# Altium project TK525_Kraftforsyning.PrjPcb
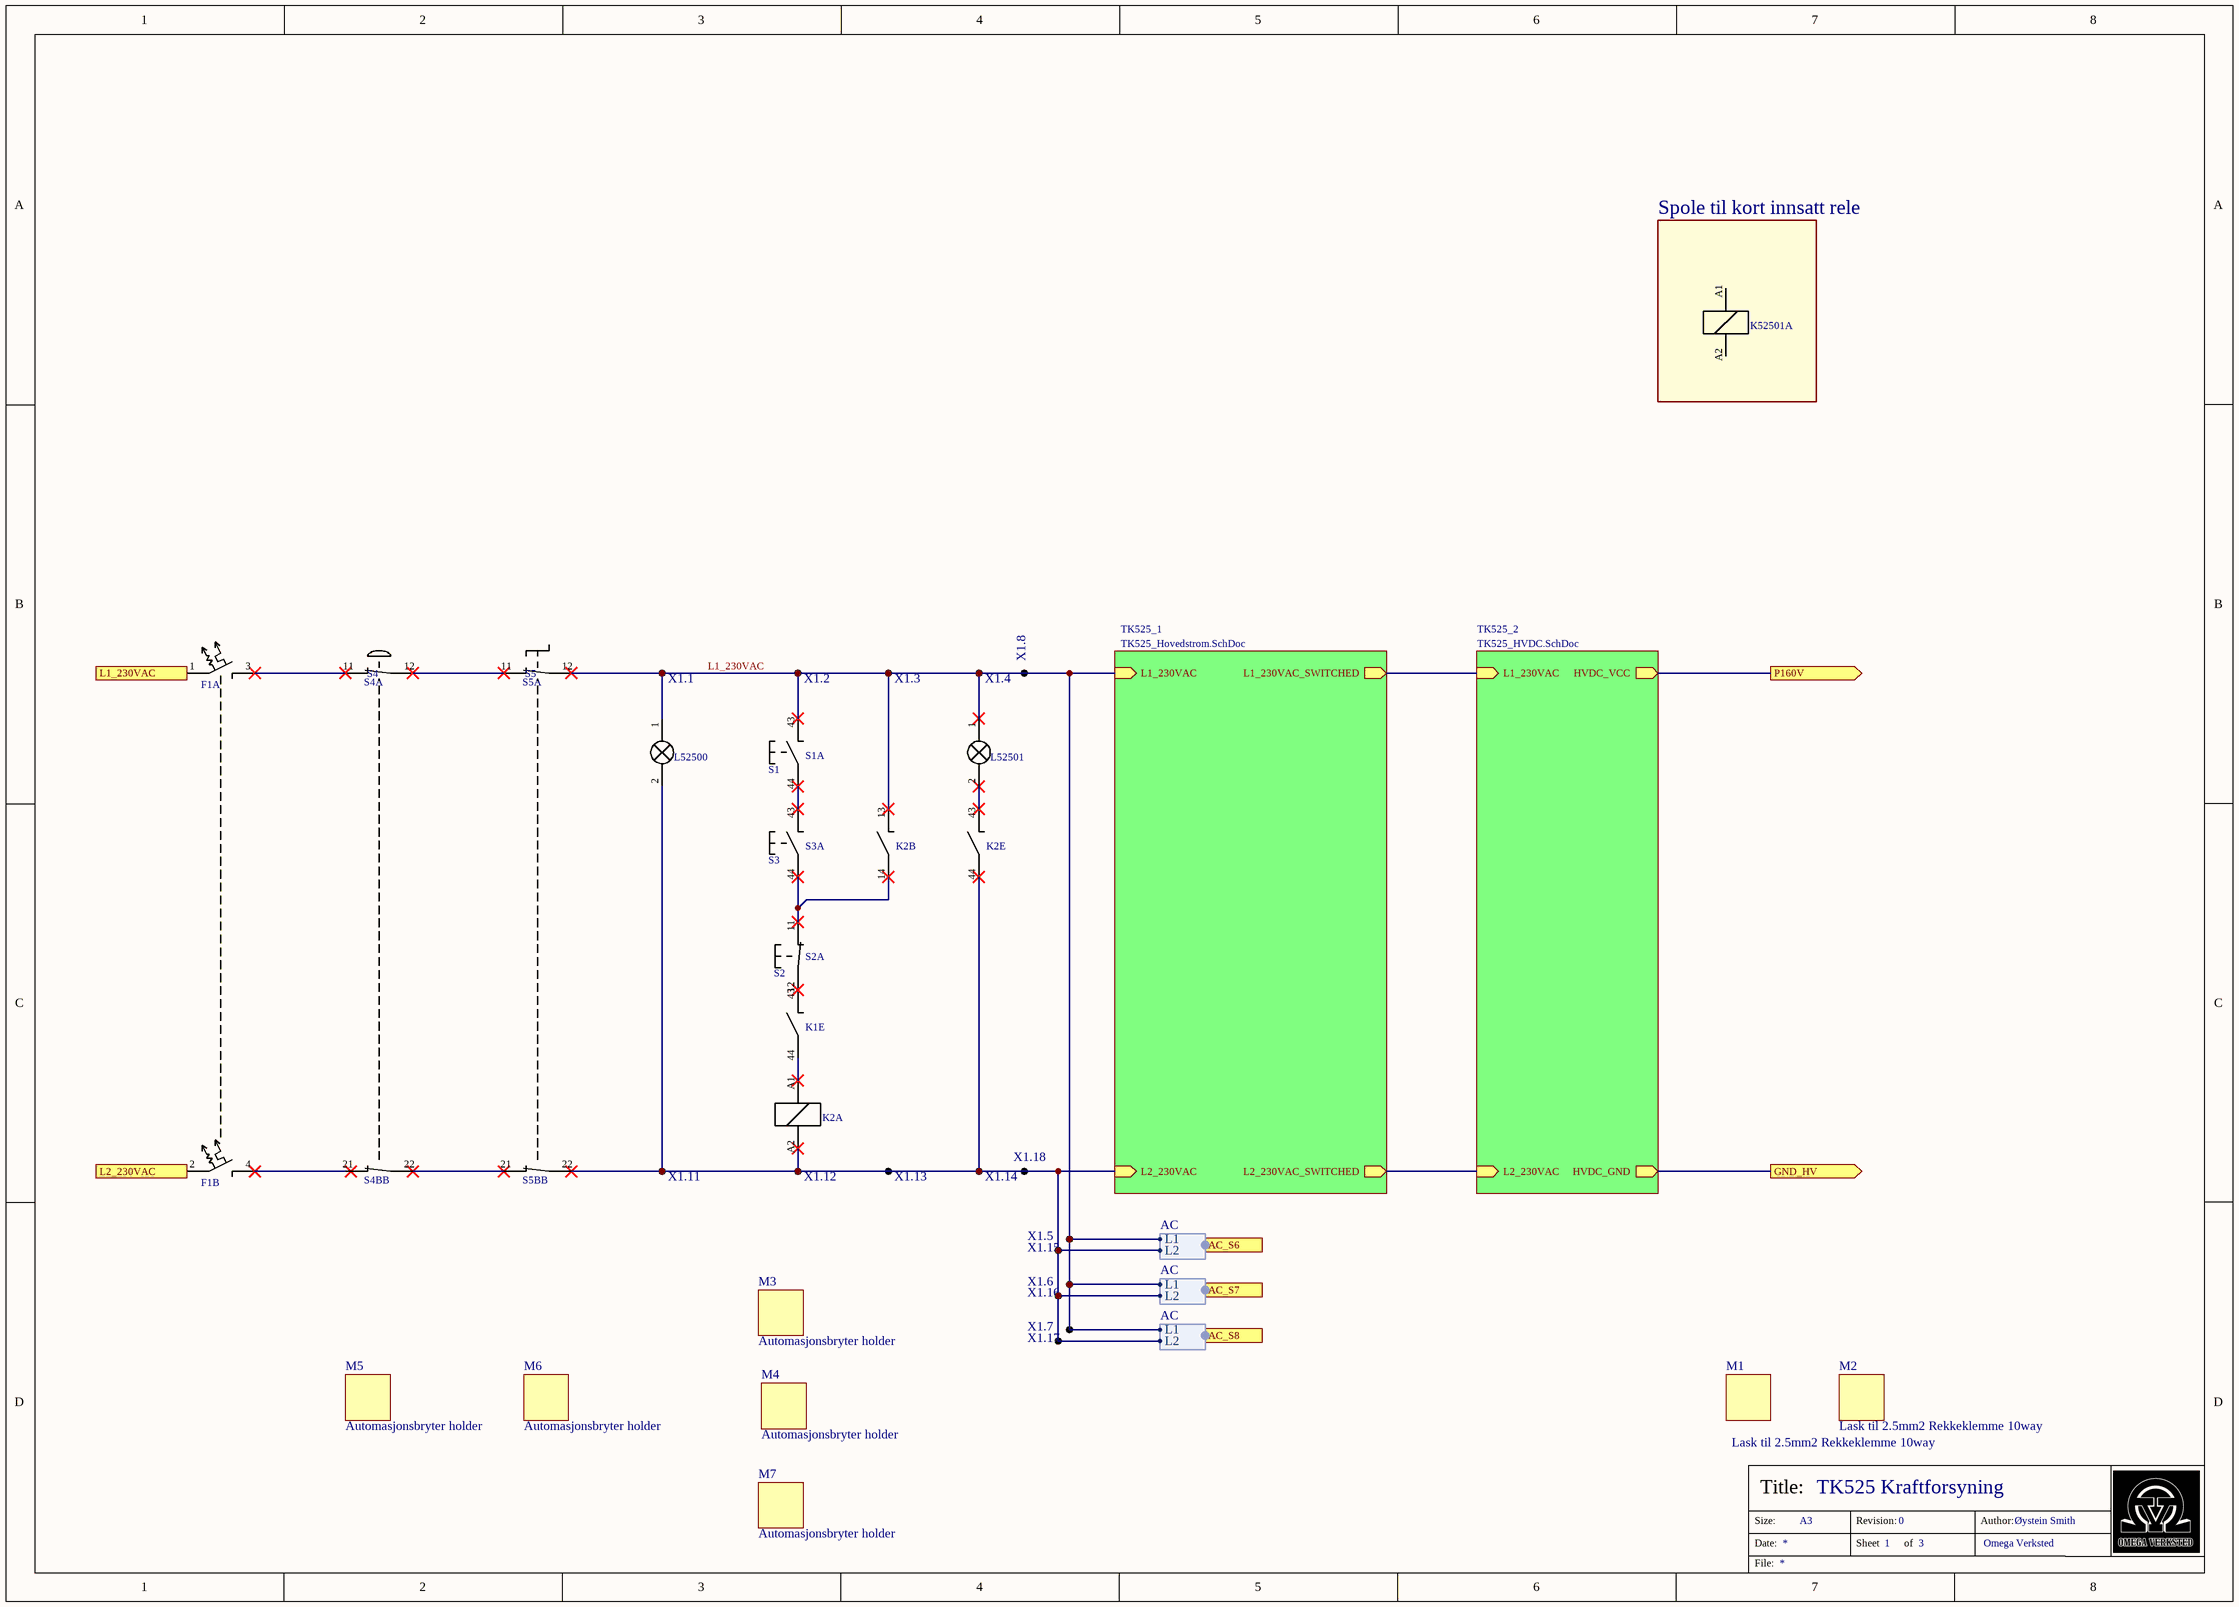
[diagram p0: TK525_Kraftforsyning.SchDoc]
3 sheets, 60 parts. Net scope: hierarchical (ports join the sheet entries above them; power ports are global).
Board file: dummy.PcbDoc
Sheets:
  TK525_Kraftforsyning.SchDoc
    TK525_1 = TK525_Hovedstrom.SchDoc
    TK525_2 = TK525_HVDC.SchDoc

## Sheet TK525_Kraftforsyning.SchDoc: TK525 Kraftforsyning
size A3; Author: Øystein Smith; Organization: Omega Verksted; DocumentNumber: 16; Revision: 0; SheetNumber: 1; SheetTotal: 3

### Parts
(Parts that share a designator on the sheet are numbered #1, #2 ... from top to bottom, then left to right.)
F1  Automatsikring  [dummy]  (value not drawn)  (parts A,B of 2)
K1  DIN-Rele 5V  [dummy]  (value not drawn)  (part E of 6)
K2  Kontaktor  [dummy]  (value not drawn)  (parts A,B,E of 6)
K52501  DIN-Rele 5V  [dummy]  (value not drawn)  (part A of 6)
L52500  Lampe  (value not drawn)
L52501#1  Lampe  (value not drawn)
M1  Lask til 2.5mm2 Rekkeklemme 10way  [dummy]
M2  Lask til 2.5mm2 Rekkeklemme 10way  [dummy]
M3  Automasjonsbryter holder  [dummy]
M4  Automasjonsbryter holder  [dummy]
M5  Automasjonsbryter holder  [dummy]
M6  Automasjonsbryter holder  [dummy]
M7  Automasjonsbryter holder  [dummy]
S1#1  Automasjonsbryter NO  [dummy]  (value not drawn)  (part A of 3)
S1#2  Automasjonsvelger Grønn  [dummy]  (value not drawn)
S2#1  Automasjonsbryter NC  [dummy]  (value not drawn)  (part A of 3)
S2#2  Automasjonsvelger Rød  [dummy]  (value not drawn)
S3#1  Automasjonsbryter NO  [dummy]  (value not drawn)  (part A of 3)
S3#2  Automasjonsvelger Grønn  [dummy]  (value not drawn)
S4#1  Automasjonsbryter NC  [dummy]  (value not drawn)  (part A of 3)
S4#2  Automasjonsvelger Nødstopp  [dummy]  (value not drawn)
S4B  Automasjonsbryter NC  [dummy]  (value not drawn)  (part B of 3)
S5#1  Automasjonsbryter NC  [dummy]  (value not drawn)  (part A of 3)
S5#2  Automasjonsvelger Vrider bistabil  [dummy]  (value not drawn)
S5B  Automasjonsbryter NC  [dummy]  (value not drawn)  (part B of 3)
X1.1  Rekkeklemme 2.5mm2  [dummy]  (value not drawn)
X1.2  Rekkeklemme 2.5mm2  [dummy]  (value not drawn)
X1.3  Rekkeklemme 2.5mm2  [dummy]  (value not drawn)
X1.4  Rekkeklemme 2.5mm2  [dummy]  (value not drawn)
X1.5  Rekkeklemme 2.5mm2  [dummy]  (value not drawn)
X1.6  Rekkeklemme 2.5mm2  [dummy]  (value not drawn)
X1.7  Rekkeklemme 2.5mm2  [dummy]  (value not drawn)
X1.8  Rekkeklemme 2.5mm2  [dummy]  (value not drawn)
X1.11  Rekkeklemme 2.5mm2  [dummy]  (value not drawn)
X1.12  Rekkeklemme 2.5mm2  [dummy]  (value not drawn)
X1.13  Rekkeklemme 2.5mm2  [dummy]  (value not drawn)
X1.14  Rekkeklemme 2.5mm2  [dummy]  (value not drawn)
X1.15  Rekkeklemme 2.5mm2  [dummy]  (value not drawn)
X1.16  Rekkeklemme 2.5mm2  [dummy]  (value not drawn)
X1.17  Rekkeklemme 2.5mm2  [dummy]  (value not drawn)
X1.18  Rekkeklemme 2.5mm2  [dummy]  (value not drawn)

### Blocks framed on the sheet
Spole til kort innsatt rele: K52501

### Sub-sheets
TK525_1 = TK525_Hovedstrom.SchDoc: L1_230VAC (in), L2_230VAC (in), L1_230VAC_SWITCHED (out), L2_230VAC_SWITCHED (out)
TK525_2 = TK525_HVDC.SchDoc: L2_230VAC (in), L1_230VAC (in), HVDC_GND (out), HVDC_VCC (out)

### Ports
AC_S6 (harness AC), AC_S7 (harness AC), AC_S8 (harness AC), GND_HV (out), L1_230VAC (in), L2_230VAC (in), P160V (out)

### Harnesses
AC: L1, L2

### Nets
L1_230VAC: K2.13 L52500.1 L52501#1.1 S1#1.43 S5#1.12 ; sheet TK525_1/L1_230VAC, port AC_S6.L1, port AC_S7.L1, port AC_S8.L1
NetC52500_1: port GND_HV, sheet TK525_2/HVDC_GND
NetC52500_2: port P160V, sheet TK525_2/HVDC_VCC
NetF1_1: F1.1 ; port L1_230VAC
NetF1_2: F1.2 ; port L2_230VAC
NetF1_3: F1.3 S4#1.11
NetF1_4: F1.4 S4B.21
NetK1_43: K1.43 S2#1.12
NetK1_44: K1.44 K2.A1
NetK2_14: K2.14 S2#1.11 S3#1.44
NetK2_43: K2.43 L52501#1.2
NetK2_44: K2.44 K2.A2 L52500.2 S5B.22 ; sheet TK525_1/L2_230VAC, port AC_S6.L2, port AC_S7.L2, port AC_S8.L2
NetK2_54: sheet TK525_1/L1_230VAC_SWITCHED, sheet TK525_2/L1_230VAC
NetK2_64: sheet TK525_1/L2_230VAC_SWITCHED, sheet TK525_2/L2_230VAC
NetS1#1_44: S1#1.44 S3#1.43
NetS4#1_12: S4#1.12 S5#1.11
NetS4B_22: S4B.22 S5B.21

Not connected (* = marked no-connect by the designer): K52501 A1 A2

### Notes on the sheet
- Size:
- Date:
- Title:
- A3
- Revision:
- Sheet
- of
- Author:
- File:

### Library data of the parts
F1 = 2977: 2-Pol; id: 2977; symbol_opprettet_av: 815; leverandor_varenr: 2492800; pris: 362; nokkelord: Sikring, Fuse; produsent: ABB; leverandor: Farnell; pakketype: DIN; symbol_opprettet: 05/07/2015 13:21:53; navn: Automatsikring; pakke_opprettet_av: 815; pakke_opprettet: 02/11/2021 00:12:53
K1 K52501 = 3272: Coil: 5VDC, Contact: 250VAC 6A, DIN mount; id: 3272; symbol_opprettet_av: 815; leverandor_varenr: 1895933; pris: 310; produsent: ABB; leverandor: Farnell; symbol_opprettet: 04/07/2015 12:23:41; navn: DIN-Rele 5V; pakketype: -; pakke_opprettet_av: 815; pakke_opprettet: 02/11/2021 00:12:53
K2 = 2948: Industriellt rele; id: 2948; symbol_opprettet_av: 815; leverandor_varenr: 9940480; pris: 300; produsent: IMO; leverandor: Farnell; symbol_opprettet: 04/07/2015 12:23:41; navn: Kontaktor; nokkelord: Contactor; pakketype: -; pakke_opprettet_av: 815; pakke_opprettet: 02/11/2021 00:12:53
L52500 L52501#1 = 4773: Lampe, Generisk for skjema; id: 4773; symbol_opprettet_av: 815; pris: 0; symbol_opprettet: 05/07/2015 14:08:53; navn: Lampe; nokkelord: Lamp; pakketype: -
M1 M2 = 3273: Jumper (Busbar), Cross Jumper, DIN Rail Screw Clamp Terminal Blocks, 10 Ways; id: 3273; symbol_opprettet_av: 815; leverandor_varenr: 2061384; pris: 17; produsent: Multicomp; leverandor: Farnell; symbol_opprettet: 12/03/2017 01:13:28; navn: Lask til 2.5mm2 Rekkeklemme 10way; pakketype: -; pakke_opprettet_av: 815; pakke_opprettet: 02/11/2021 00:12:53
M3-M7 = 6258: Assembly Hardware, Siemens 3-Way Modules, Holder, SIRIUS ACT 3SU Series; id: 6258; symbol_opprettet_av: 815; leverandor_varenr: 2695729; pris: 34; nokkelord: bryter, switch, tesla; leverandor: Farnell; symbol_opprettet: 12/03/2017 01:13:28; navn: Automasjonsbryter holder; produsent: Siemens; pakke_opprettet_av: 815; pakke_opprettet: 02/11/2021 00:12:53
S1#1 S3#1 = 6257: Contact Block, SPST-NO, 10 A, 500 V, 1 Pole, 3SU Series, Screw; id: 6257; symbol_opprettet_av: 815; leverandor_varenr: 2695771; pris: 80; nokkelord: bryter, switch, tesla; produsent: Siemens; leverandor: Farnell; symbol_opprettet: 01/11/2021 23:46:02; navn: Automasjonsbryter NO; pakke_opprettet_av: 815; pakke_opprettet: 02/11/2021 00:12:53
S1#2 S3#2 = 6252: Switch Actuator, Siemens 22mm Pushbutton Switches; id: 6252; symbol_opprettet_av: 815; leverandor_varenr: 2695623; pris: 78; nokkelord: automasjonsbryter, siemens; leverandor: Farnell; symbol_opprettet: 01/11/2021 23:43:07; navn: Automasjonsvelger Grønn; produsent: Siemens; pakke_opprettet_av: 815; pakke_opprettet: 02/11/2021 00:12:53
S2#1 S4#1 S4B S5#1 S5B = 6256: Contact Block, SPST-NC, 10 A, 500 V, 1 Pole, 3SU Series, Screw; id: 6256; symbol_opprettet_av: 815; leverandor_varenr: 2695772; pris: 80; nokkelord: bryter, switch, tesla; produsent: Siemens; leverandor: Farnell; symbol_opprettet: 01/11/2021 23:45:21; navn: Automasjonsbryter NC; pakke_opprettet_av: 815; pakke_opprettet: 02/11/2021 00:12:53
S2#2 = 6253: Switch Actuator, Siemens 22mm Pushbutton Switches; id: 6253; symbol_opprettet_av: 815; leverandor_varenr: 2695622; pris: 78; nokkelord: automasjonsbryter, siemens; leverandor: Farnell; symbol_opprettet: 01/11/2021 23:43:07; navn: Automasjonsvelger Rød; produsent: Siemens; pakke_opprettet_av: 815; pakke_opprettet: 02/11/2021 00:12:53
S4#2 = 6255: Switch Actuator, Siemens 22mm Emergency Stop Mushroom Pushbutton Switches; id: 6255; symbol_opprettet_av: 815; leverandor_varenr: 2695631; pris: 355; nokkelord: automasjonsbryter, siemens; leverandor: Farnell; symbol_opprettet: 01/11/2021 23:41:57; navn: Automasjonsvelger Nødstopp; produsent: Siemens; pakke_opprettet_av: 815; pakke_opprettet: 02/11/2021 00:12:53
S5#2 = 6254: Switch Actuator, Siemens 22mm Selector Switches; id: 6254; symbol_opprettet_av: 815; leverandor_varenr: 2695653; pris: 168; nokkelord: automasjonsbryter, siemens; leverandor: Farnell; symbol_opprettet: 01/11/2021 23:44:13; navn: Automasjonsvelger Vrider bistabil; produsent: Siemens; pakke_opprettet_av: 815; pakke_opprettet: 02/11/2021 00:12:53
X1.1-X1.8 X1.11-X1.18 = 3304: DIN Rail mount terminal block; id: 3304; symbol_opprettet_av: 815; leverandor_varenr: 2061376; pris: 5; nokkelord: CDU2.5; produsent: Multicomp; leverandor: Farnell; komponenttype: 11; symbol_opprettet: 12/03/2017 00:15:42; navn: Rekkeklemme 2.5mm2; pakketype: -; pakke_opprettet_av: 815; pakke_opprettet: 02/11/2021 00:12:53

## Sheet TK525_Hovedstrom.SchDoc: TK525 Hovedstrøm
size A3; Author: Øystein Smith; Organization: Omega Verksted; DocumentNumber: 14; Revision: 0; SheetNumber: 2; SheetTotal: 3
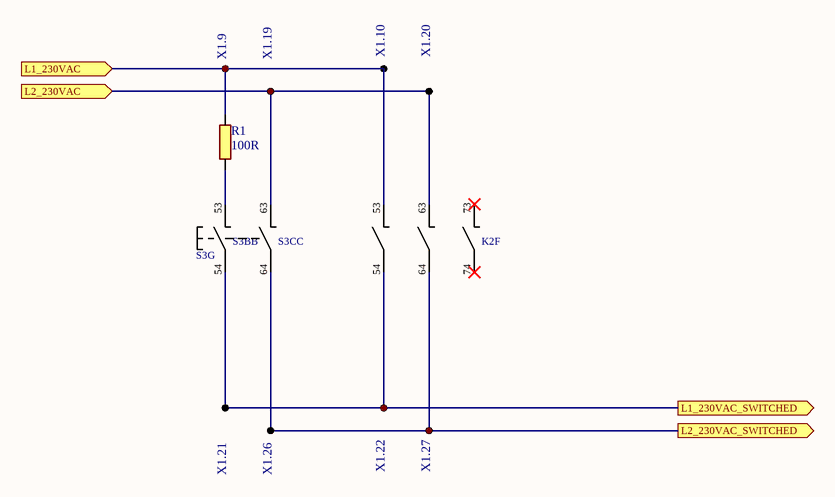
[diagram p1: TK525_Hovedstrom.SchDoc]

### Parts
(Parts that share a designator on the sheet are numbered #1, #2 ... from top to bottom, then left to right.)
K2  Kontaktor  [dummy]  (value not drawn)  (part F of 6)
R1  100R  [dummy]
S3#3  Automasjonsbryter  (value not drawn)  (part G of 10)
S3B#1  Automasjonsbryter NO  [dummy]  (value not drawn)  (part B of 3)
S3C  Automasjonsbryter NO  [dummy]  (value not drawn)  (part C of 3)
X1.9  Rekkeklemme 2.5mm2  [dummy]  (value not drawn)
X1.10  Rekkeklemme 2.5mm2  [dummy]  (value not drawn)
X1.19  Rekkeklemme 2.5mm2  [dummy]  (value not drawn)
X1.20  Rekkeklemme 2.5mm2  [dummy]  (value not drawn)
X1.21  Rekkeklemme 2.5mm2  [dummy]  (value not drawn)
X1.22  Rekkeklemme 2.5mm2  [dummy]  (value not drawn)
X1.26  Rekkeklemme 2.5mm2  [dummy]  (value not drawn)
X1.27  Rekkeklemme 2.5mm2  [dummy]  (value not drawn)

### Ports
L1_230VAC (in), L1_230VAC_SWITCHED (out), L2_230VAC (in), L2_230VAC_SWITCHED (out)

### Nets
L1_230VAC: K2.53 R1.2 ; port L1_230VAC
NetK2_44: K2.63 S3C.63 ; port L2_230VAC
NetK2_54: K2.54 S3B#1.54 ; port L1_230VAC_SWITCHED
NetK2_64: K2.64 S3C.64 ; port L2_230VAC_SWITCHED
NetR1_1: R1.1 S3B#1.53

Not connected (* = marked no-connect by the designer): K2 73* 74*

### Notes on the sheet
- Size:
- Date:
- Title:
- A3
- Revision:
- Sheet
- of
- Author:
- File:

### Library data of the parts
K2 = 2948: as K2 on sheet TK525_Kraftforsyning; symbol_opprettet: 04/07/2015 12:23:41; navn: Kontaktor; nokkelord: Contactor; pakketype: -; pakke_opprettet_av: 815; pakke_opprettet: 02/11/2021 00:12:53
R1 = 6251: 100 Ohm, 100W Resistor, Solder Lug, Wirewound +-5% 1.9kV; id: 6251; symbol_opprettet_av: 815; leverandor_varenr: 1768214; pris: 250; nokkelord: Motstand, resistor, 100, tesla, effekt, effektmotstand, power, lampe; produsent: TT electronics; leverandor: Farnell; komponenttype: 1; symbol_opprettet: 08/07/2014 21:16:33; navn: 100R; pakke_opprettet_av: 815; pakke_opprettet: 02/11/2021 00:12:53
S3#3 = 2949: Kraftig, Generisk for skjema; id: 2949; symbol_opprettet_av: 815; pris: 100; symbol_opprettet: 05/07/2015 13:10:20; navn: Automasjonsbryter; pakketype: -
S3B#1 S3C = 6257: as S1#1 on sheet TK525_Kraftforsyning; symbol_opprettet: 01/11/2021 23:46:02; navn: Automasjonsbryter NO; pakke_opprettet_av: 815; pakke_opprettet: 02/11/2021 00:12:53
X1.9 X1.10 X1.19-X1.22 X1.26 X1.27 = 3304: as X1.1 on sheet TK525_Kraftforsyning; symbol_opprettet: 12/03/2017 00:15:42; navn: Rekkeklemme 2.5mm2; pakketype: -; pakke_opprettet_av: 815; pakke_opprettet: 02/11/2021 00:12:53

## Sheet TK525_HVDC.SchDoc: TK525 HVDC
size A3; Author: Øystein Smith; Organization: Omega Verksted; DocumentNumber: 15; Revision: 0; SheetNumber: 3; SheetTotal: 3
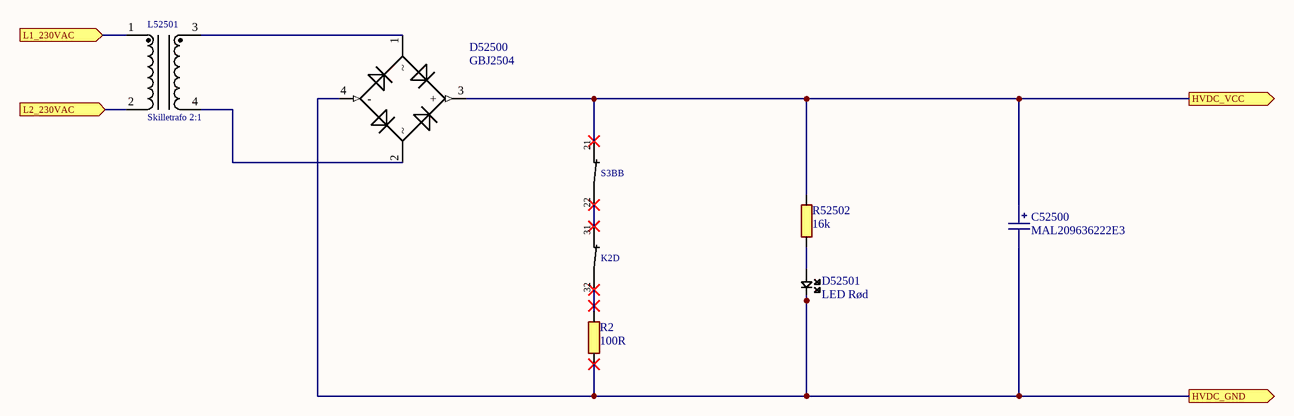
[diagram p2: TK525_HVDC.SchDoc]

### Parts
(Parts that share a designator on the sheet are numbered #1, #2 ... from top to bottom, then left to right.)
C52500  MAL209636222E3  [dummy]
D52500  GBJ2504  [dummy]
D52501  LED Rød  [LED254W7L870D500]
K2  Kontaktor  [dummy]  (value not drawn)  (part D of 6)
L52501#2  Skilletrafo 2:1  [dummy]
R2  100R  [dummy]
R52502  16k  [RESA_0.25W]
S3B#2  Automasjonsbryter NC  [dummy]  (value not drawn)  (part B of 3)

### Ports
HVDC_GND (out), HVDC_VCC (out), L1_230VAC (in), L2_230VAC (in)

### Nets
NetC52500_1: C52500.1 D52500.4(-) D52501.2 R2.1 ; port HVDC_GND
NetC52500_2: C52500.2 D52500.3(+) R52502.2 S3B#2.21 ; port HVDC_VCC
NetD52500_1: D52500.1 L52501#2.3
NetD52500_2: D52500.2 L52501#2.4
NetD52501_1: D52501.1 R52502.1
NetK2_31: K2.31 S3B#2.22
NetK2_32: K2.32 R2.2
NetK2_54: L52501#2.1 ; port L1_230VAC
NetK2_64: L52501#2.2 ; port L2_230VAC

### Notes on the sheet
- Size:
- Date:
- Title:
- A3
- Revision:
- Sheet
- of
- Author:
- File:

### Library data of the parts
C52500 = 3076: CAP, ALU ELEC, 2200UF, 400V; id: 3076; symbol_opprettet_av: 815; leverandor_varenr: 2342176; pris: 340; nokkelord: Capacitor, Kondensator; produsent: Vishay; leverandor: Farnell; pakketype: TH; komponenttype: 2; symbol_opprettet: 28/06/2014 15:26:13; navn: MAL209636222E3; pakke_opprettet_av: 815; pakke_opprettet: 02/11/2021 00:12:53
D52500 = 3322: diodebro/Likeretterbro 400V 25A; id: 3322; rad: 7; rom: OV; lager_type: Baklager; dybde: 0; antall: 43; symbol_opprettet_av: 815; leverandor_varenr: 1651042; pris: 16; nokkelord: bro, diodebro, bridge; leverandor: Farnell; pakketype: TH; komponenttype: 9; hylle: 7; symbol_opprettet: 09/06/2015 22:09:39; navn: GBJ2504; pakke_opprettet_av: 815; pakke_opprettet: 02/11/2021 00:12:53
D52501 = 3117: Farget LED, 5mm; id: 3117; rad: 6; rom: OV; lager_type: Fremlager; dybde: 0; hylle: 4; antall: 59; pakke_opprettet_av: 1366; symbol_opprettet_av: 815; pris: 1; nokkelord: LED, rød, red, 5mm, diode, lys, light,  led 5mm; komponenttype: 9; pakke_opprettet: 09/02/2016 18:21:00; symbol_opprettet: 06/07/2014 18:59:47; navn: LED Rød; produsent: -; pakketype: -
K2 = 2948: as K2 on sheet TK525_Kraftforsyning; symbol_opprettet: 04/07/2015 12:23:41; navn: Kontaktor; nokkelord: Contactor; pakketype: -; pakke_opprettet_av: 815; pakke_opprettet: 02/11/2021 00:12:53
L52501#2 = 3842: Skilletrafo Ringkjerne; rad: 4; rom: OV; lager_type: Fremlager; dybde: 0; hylle: 2; antall: 40; pakke_opprettet_av: 815; pris: 1900; nokkelord: Trafo, transformer; produsent: Hammond; id: 3842; leverandor_varenr: 2546942; leverandor: Farnell; komponenttype: 3; navn: Skilletrafo 2:1; kolonne: 4; pakke_opprettet: 02/11/2021 00:12:53; symbol_opprettet_av: 815; symbol_opprettet: 30/04/2016 00:07:18; pakketype: -
R2 = 6251: as R1 on sheet TK525_Hovedstrom; symbol_opprettet: 08/07/2014 21:16:33; navn: 100R; pakke_opprettet_av: 815; pakke_opprettet: 02/11/2021 00:12:53
R52502 = 3759: 0.25W 1% Generic resistor; id: 3759; rad: 7; rom: OV; lager_type: Fremlager; dybde: 1; hylle: 5; antall: 99; pakke_opprettet_av: 815; pris: 0; nokkelord: Motstand, Resistor; pakketype: TH; pakke_opprettet: 28/06/2014 17:13:33; symbol_opprettet_av: 815; symbol_opprettet: 08/07/2014 21:16:33; navn: 16k; komponenttype: 1
S3B#2 = 6256: as S2#1 on sheet TK525_Kraftforsyning; symbol_opprettet: 01/11/2021 23:45:21; navn: Automasjonsbryter NC; pakke_opprettet_av: 815; pakke_opprettet: 02/11/2021 00:12:53

## Nets that join several sheets
L1_230VAC: TK525_Kraftforsyning (5 pins), TK525_Hovedstrom (K2.53 R1.2)
NetK2_44: TK525_Kraftforsyning (K2.44 K2.A2 L52500.2 S5B.22), TK525_Hovedstrom (K2.63 S3C.63)
NetK2_54: TK525_Hovedstrom (K2.54 S3B#1.54), TK525_HVDC (L52501#2.1)
NetK2_64: TK525_Hovedstrom (K2.64 S3C.64), TK525_HVDC (L52501#2.2)